# EAGLE design emonDCduo-ESP v3.3 (EAGLE 9.2.2)
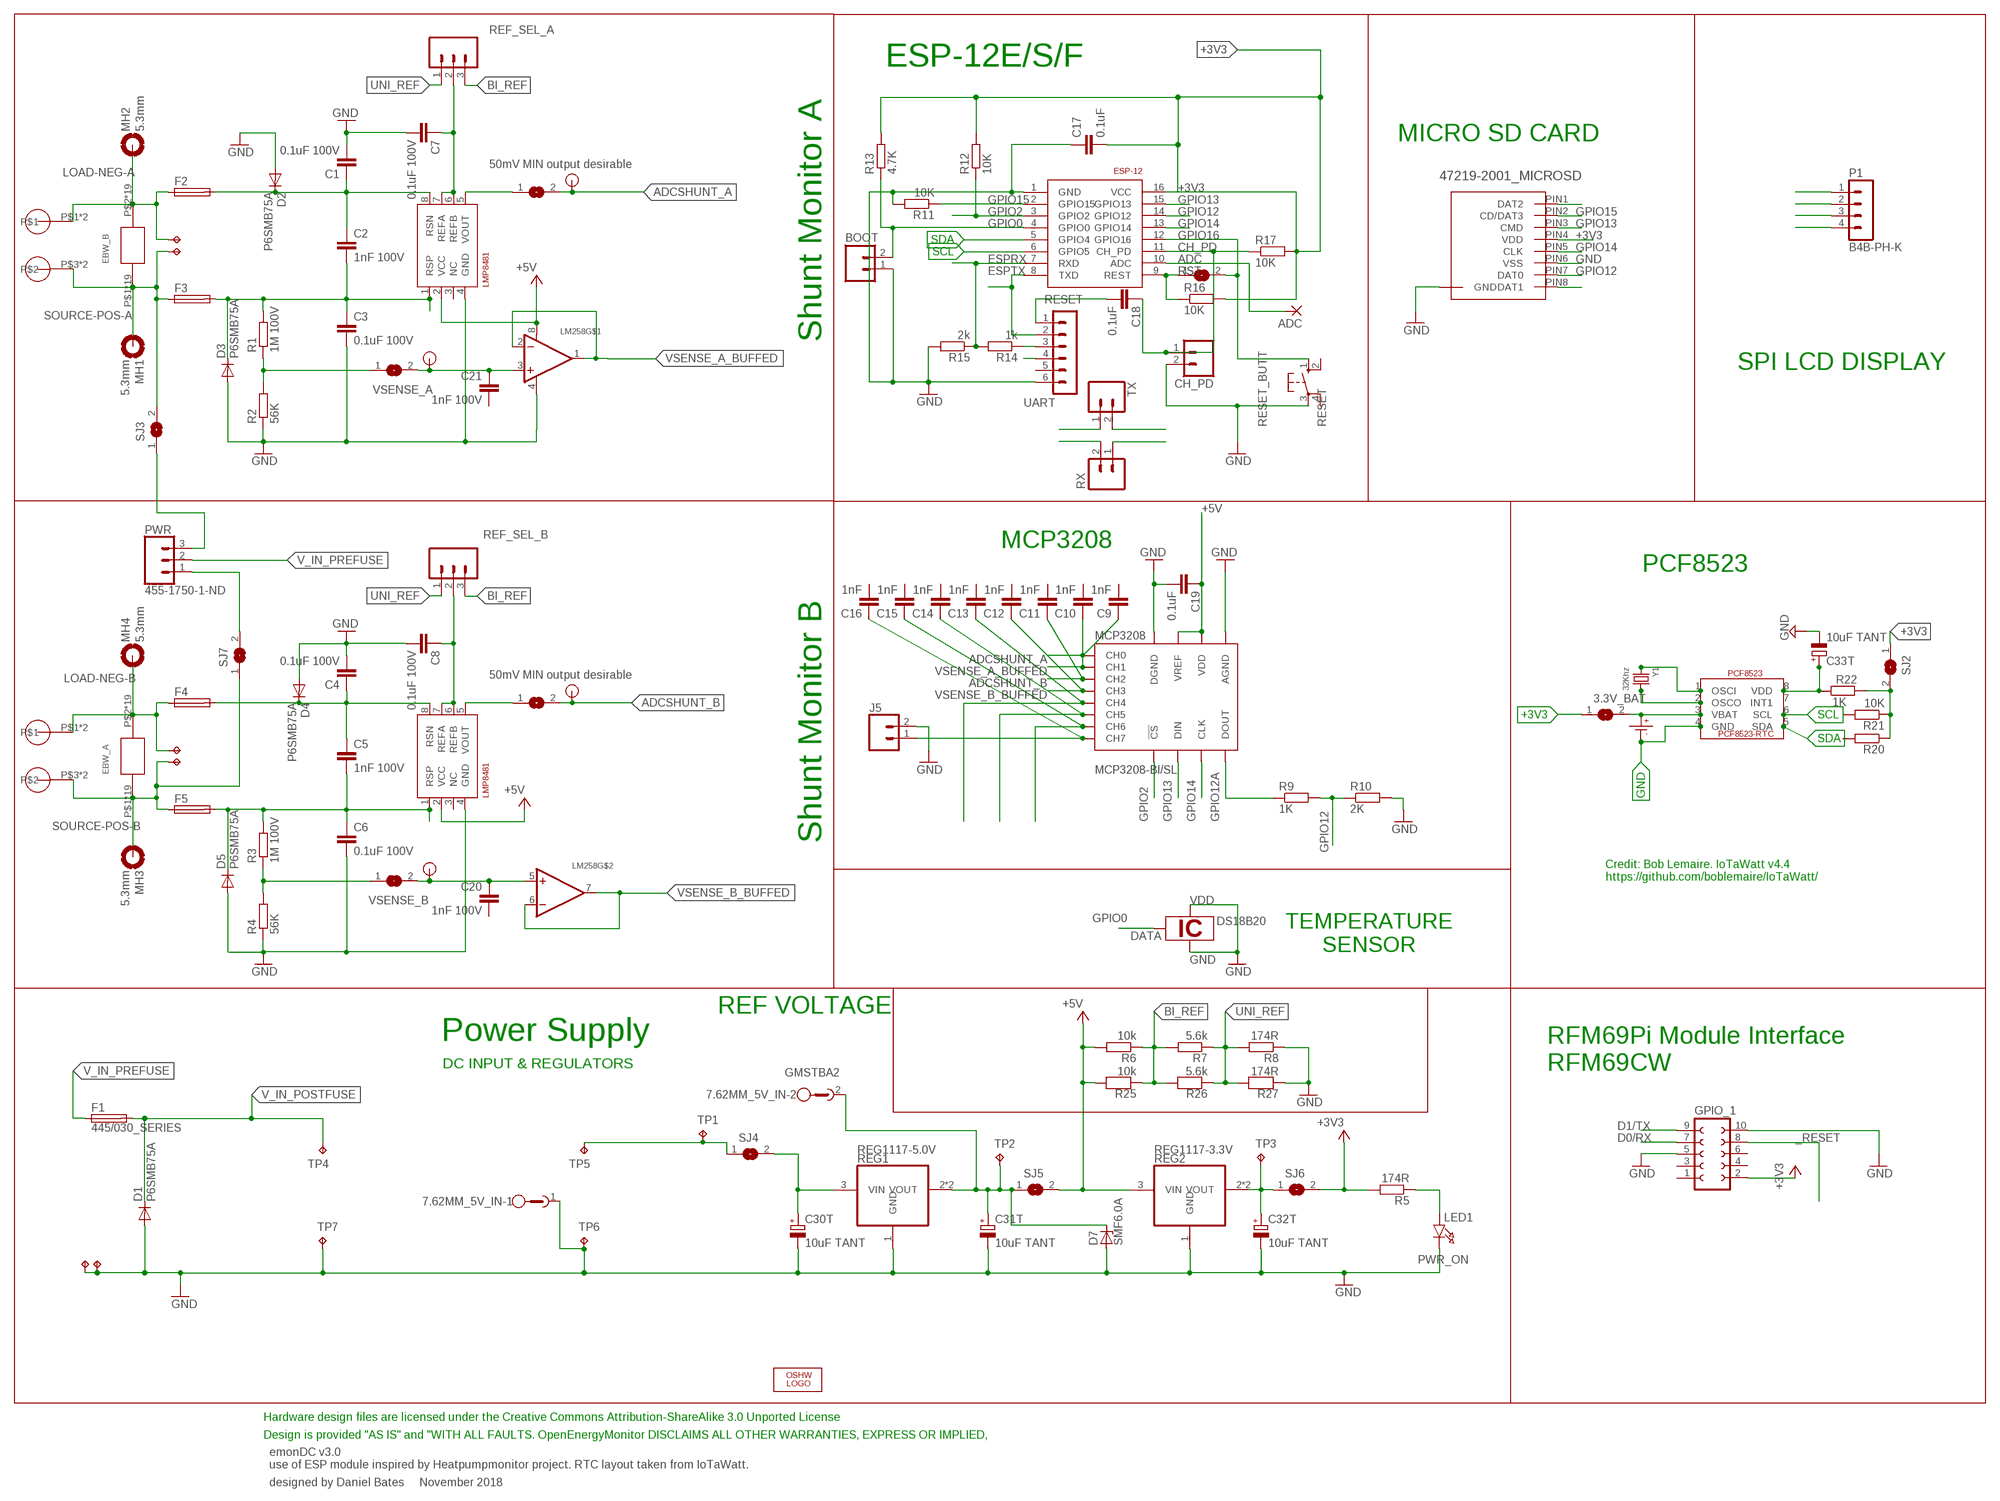
[diagram p0: schematic, sheet 1]

## Parts
3.3V_BAT  SOLDERJUMPERCLOSED  [SOLDERJUMPER_CLOSEDWIRE]
7.62MM_5V_IN  GMSTBA2  [GMSTBA2]
ADC  2,15/1,0  [2,15/1,0]
BOOT  M02PTH  [1X02]
C1  0.1uF 100V  C-EUC0603  [C0603]
C2  1nF 100V  C-EUC0603  [C0603]
C3  0.1uF 100V  C-EUC0603  [C0603]
C4  0.1uF 100V  C-EUC0603  [C0603]
C5  1nF 100V  C-EUC0603  [C0603]
C6  0.1uF 100V  C-EUC0603  [C0603]
C7  0.1uF 100V  C-EUC0603  [C0603]
C8  0.1uF 100V  C-EUC0603  [C0603]
C9  1nF  C-EUC0603  [C0603]
C10  1nF  C-EUC0603  [C0603]
C11  1nF  C-EUC0603  [C0603]
C12  1nF  C-EUC0603  [C0603]
C13  1nF  C-EUC0603  [C0603]
C14  1nF  C-EUC0603  [C0603]
C15  1nF  C-EUC0603  [C0603]
C16  1nF  C-EUC0603  [C0603]
C17  0.1uF  C-EUC0603  [C0603]
C18  0.1uF  C-EUC0603  [C0603]
C19  0.1uF  C-EUC0603  [C0603]
C20  1nF 100V  C-EUC0603  [C0603]
C21  1nF 100V  C-EUC0603  [C0603]
C30T  10uF TANT  CPOL-EUC0603POL  [C0603POL]
C31T  10uF TANT  CPOL-EUC0603POL  [C0603POL]
C32T  10uF TANT  CPOL-EUC0603POL  [C0603POL]
C33T  10uF TANT  CPOL-EUC0603POL  [C0603POL]
CH_PD  M02PTH  [1X02]
CR1220  CR1220SMD  [CR1220SMD]
D1  P6SMB75A  DIODE-DO214AA  [DO214AA]
D2  P6SMB75A  DIODE-DO214AA  [DO214AA]
D3  P6SMB75A  DIODE-DO214AA  [DO214AA]
D4  P6SMB75A  DIODE-DO214AA  [DO214AA]
D5  P6SMB75A  DIODE-DO214AA  [DO214AA]
D7  SMF6.0A  [SOD123F]
EBW_A  EBW_SERIES_15.2MM  [EBW_SERIES_15.2MM]
EBW_B  EBW_SERIES_15.2MM  [EBW_SERIES_15.2MM]
ESP-12  ESP8266_ESP-12  [ESP8266-ESP12]
F1  445/030_SERIES  [445/030_SERIES_LITTELFUSE]
F2  TR5  [TR5]
F3  TR5  [TR5]
F4  TR5  [TR5]
F5  TR5  [TR5]
GPIO_1  FE05-2_RFM69PI_OUTLINERFM69PI  [FE05-2_RFM69PI_OULTINE]
IC1  DS18B20  [TO92-]
J5  CONN_02  [1X02]
LED1  PWR_ON  LED1206  [CHIPLED_1206]
LM258  LM358  [SOIC8_150MIL]
LOGO1  OSHW_LOGO_6MILX0200-NT  [OSHW_6X200_NOTEXT]
MCP3208  MCP3208-BI/SL  [SOIC16]
MH1  5.3mm  MOUNT-PAD-ROUND5.3  [5,3//11-PAD]
MH2  5.3mm  MOUNT-PAD-ROUND5.3  [5,3//11-PAD]
MH3  5.3mm  MOUNT-PAD-ROUND5.3  [5,3//11-PAD]
MH4  5.3mm  MOUNT-PAD-ROUND5.3  [5,3//11-PAD]
MICRO_SD  47219-2001_MICROSD  [47219-2001_MICROSD]
MOUNT_10.16_A  MOLEX_39970-003  [2/10,16]
MOUNT_10.16_B  MOLEX_39970-003  [2/10,16]
P1  B4B-PH-K  [B4B-PH-K]
PCF8523  PCF8523_RTC  [SOIC_8]
PWR  455-1750-1-ND  CONN_03  [1X03]
R1  1M 100V  R-EU_0207/2V  [0207/2V]
R2  56K  R-EU_0207/2V  [0207/2V]
R3  1M 100V  R-EU_0207/2V  [0207/2V]
R4  56K  R-EU_0207/2V  [0207/2V]
R5  174R  R-EU_R0603  [R0603]
R6  10k  R-EU_0207/10  [0207/10]
R7  5.6k  R-EU_0207/10  [0207/10]
R8  174R  R-EU_0207/10  [0207/10]
R9  1K  R-EU_R0603  [R0603]
R10  2K  R-EU_R0603  [R0603]
R11  10K  R-EU_R0603  [R0603]
R12  10K  R-EU_R0603  [R0603]
R13  4.7K  R-EU_R0603  [R0603]
R14  1k  R-EU_R0603  [R0603]
R15  2k  R-EU_R0603  [R0603]
R16  10K  R-EU_R0603  [R0603]
R17  10K  R-EU_R0603  [R0603]
R20  10K  R-EU_R0603  [R0603]
R21  10K  R-EU_R0603  [R0603]
R22  1K  R-EU_R0603  [R0603]
R25  10k  RESISTOR0603  [0603]
R26  5.6k  RESISTOR0603  [0603]
R27  174R  RESISTOR0603  [0603]
REF_SEL_A  455-1750-1-ND  CONN_03  [1X03]
REF_SEL_B  455-1750-1-ND  CONN_03  [1X03]
REG1  REG1117-5.0V  REG1117  [SOT223]
REG2  REG1117-3.3V  REG1117  [SOT223]
RESET  RESET_BUTT  10-XX  [B3F-10XX]
RX  M02PTH  [1X02]
SHUNTMON-A  LMP8481  LMP8481-H  [S-PDSO-G08]
SHUNTMON-B  LMP8481  LMP8481-H  [S-PDSO-G08]
SJ1  SOLDERJUMPERCLOSED  [SOLDERJUMPER_CLOSEDWIRE]
SJ2  SOLDERJUMPERCLOSED  [SOLDERJUMPER_CLOSEDWIRE]
SJ3  SJ  [SJ]
SJ4  SOLDERJUMPERCLOSED  [SOLDERJUMPER_CLOSEDWIRE]
SJ5  SOLDERJUMPERCLOSED  [SOLDERJUMPER_CLOSEDWIRE]
SJ6  SOLDERJUMPERCLOSED  [SOLDERJUMPER_CLOSEDWIRE]
SJ7  SJ  [SJ]
SJ8  SOLDERJUMPERCLOSED  [SOLDERJUMPER_CLOSEDWIRE]
SJ9  SOLDERJUMPERCLOSED  [SOLDERJUMPER_CLOSEDWIRE]
SJ10  SOLDERJUMPERCLOSED  [SOLDERJUMPER_CLOSEDWIRE]
SJ11  SOLDERJUMPERCLOSED  [SOLDERJUMPER_CLOSEDWIRE]
TP1  TPPAD1-13  [P1-13]
TP2  TPPAD1-13  [P1-13]
TP3  TPPAD1-13  [P1-13]
TP4  TPPAD1-13Y  [P1-13Y]
TP5  TPPAD1-13Y  [P1-13Y]
TP6  TPPAD1-13Y  [P1-13Y]
TP7  TPPAD1-13Y  [P1-13Y]
TP8  TPPAD1-13Y  [P1-13Y]
TP9  TPPAD1-13Y  [P1-13Y]
TP10  TPPAD1-13Y  [P1-13Y]
TP11  TPPAD1-13Y  [P1-13Y]
TP12  TPPAD1-13Y  [P1-13Y]
TP13  TPPAD1-13Y  [P1-13Y]
TX  M02PTH  [1X02]
U$1  TP1.0MM  [TP1.0]
U$4  TP1.0MM  [TP1.0]
U$5  TP1.0MM  [TP1.0]
U$6  TP1.0MM  [TP1.0]
UART  UART  MA06-1  [MA06-1]
Y1  32Khz  CRYSTAL8X3.8SMT  [CRYSTAL_8X3.8]

## Nets
3.3V_PRE [thin_power]: C32T.1(+) REG2.2(VOUT) REG2.4(VOUT) SJ6.1 TP3.TP
5V_PRE [thin_power]: 7.62MM_5V_IN.2 C31T.1(+) D7.C REG1.2(VOUT) REG1.4(VOUT) SJ5.1 TP2.TP
6.5V [thin_power]: C30T.1(+) REG1.3(VIN) SJ4.2
+3V3 [thin_power2]: 3.3V_BAT.1 C15.1 C17.2 ESP-12.16(VCC) GPIO_1.2 MCP3208.7(CH6) MICRO_SD.PIN4(VDD) P1.3 R5.2 R12.2 R13.2 R16.2 R17.2 SJ2.1 SJ6.2
+5V [thin_power2]: C19.1 LM258.8(V+) MCP3208.15(VREF) MCP3208.16(VDD) R6.2 R25.2 REG2.3(VIN) SHUNTMON-A.2(VCC) SHUNTMON-B.2(VCC) SJ5.2 UART.4
_RESET: GPIO_1.8
ADC: ADC.1(P) ESP-12.10(ADC)
ADCSHUNT_A: C9.1 MCP3208.1(CH0) SJ11.2 U$6.P$1
ADCSHUNT_B: C11.1 MCP3208.3(CH2) SJ10.2 U$5.P$1
BI_REF: C13.1 MCP3208.5(CH4) R6.1 R7.2 R25.1 R26.2 REF_SEL_A.3 REF_SEL_B.3
CH7: C16.1 J5.1 MCP3208.8(CH7)
CH_PD: C18.1 CH_PD.1 ESP-12.11(CH_PD) R17.1
D0/RX: GPIO_1.7 TX.2
D1/TX: GPIO_1.9 RX.1
ESPRX: ESP-12.7(RXD) R14.2 R15.1 RX.2
ESPTX: ESP-12.8(TXD) TX.1 UART.2
GND: 7.62MM_5V_IN.1 BOOT.1 C1.2 C3.2 C4.2 C6.2 C7.2 C8.2 C17.1 C19.2 C30T.2(-) C31T.2(-) C32T.2(-) C33T.2(-) CH_PD.2 CR1220.P-(P$-) D1.A D2.A D3.A D4.A D5.A D7.A ESP-12.1(GND) GPIO_1.5 GPIO_1.10 IC1.1(GND) IC1.3(VDD) J5.2 LED1.C LM258.4(V-) MCP3208.9(DGND) MCP3208.14(AGND) MICRO_SD.P$1(GND) MICRO_SD.P$2(GND) MICRO_SD.P$3(GND) MICRO_SD.P$4(GND) MICRO_SD.PIN6(VSS) P1.4 PCF8523.4(GND) R2.1 R4.1 R8.1 R10.2 R11.2 R15.2 R27.1 REG1.1(GND) REG2.1(GND) RESET.3(P) SHUNTMON-A.4(GND) SHUNTMON-B.4(GND) TP6.TP TP7.TP TP12.TP TP13.TP UART.6
GPIO0: BOOT.2 ESP-12.4(GPIO0) IC1.2(DATA) R13.1
GPIO2: ESP-12.3(GPIO2) MCP3208.10(!CS) R12.1
GPIO12: ESP-12.14(GPIO12) MICRO_SD.PIN7(DAT0) R9.2 R10.1
GPIO12A: MCP3208.12(DOUT) R9.1
GPIO13: ESP-12.15(GPIO13) MCP3208.11(DIN) MICRO_SD.PIN3(CMD)
GPIO14: ESP-12.13(GPIO14) MCP3208.13(CLK) MICRO_SD.PIN5(CLK)
GPIO15: ESP-12.2(GPIO15) MICRO_SD.PIN2(CD/DAT3) R11.1
GPIO16: ESP-12.12(GPIO16) RESET.1(S) SJ1.2
LOAD-NEG-A [power]: EBW_B.P$2 EBW_B.P$18 EBW_B.P$19 EBW_B.P$20 EBW_B.P$21 EBW_B.P$22 EBW_B.P$23 EBW_B.P$24 EBW_B.P$25 EBW_B.P$26 EBW_B.P$27 EBW_B.P$28 EBW_B.P$29 EBW_B.P$30 EBW_B.P$31 EBW_B.P$32 EBW_B.P$36 EBW_B.P$37 EBW_B.P$38 F2.1 MH2.B5,5(MOUNT) MOUNT_10.16_A.P$1 MOUNT_10.16_A.P$2 TP11.TP
LOAD-NEG-A_T [thin_power]: C1.1 C2.1 D2.C F2.2 SHUNTMON-A.8(RSN)
LOAD-NEG-B [power]: EBW_A.P$2 EBW_A.P$18 EBW_A.P$19 EBW_A.P$20 EBW_A.P$21 EBW_A.P$22 EBW_A.P$23 EBW_A.P$24 EBW_A.P$25 EBW_A.P$26 EBW_A.P$27 EBW_A.P$28 EBW_A.P$29 EBW_A.P$30 EBW_A.P$31 EBW_A.P$32 EBW_A.P$36 EBW_A.P$37 EBW_A.P$38 F4.1 MH4.B5,5(MOUNT) MOUNT_10.16_B.P$1 MOUNT_10.16_B.P$2 TP9.TP
LOAD-NEG-B_T [thin_power]: C4.1 C5.1 D4.C F4.2 SHUNTMON-B.8(RSN)
N$1: SJ4.1 TP1.TP TP5.TP
N$3 [power]: PWR.3 SJ3.1
N$4 [power]: PWR.1 SJ7.2
N$5: LED1.A R5.1
N$7: MICRO_SD.PIN1(DAT2)
N$10: SHUNTMON-B.5(VOUT) SJ10.1
N$11: SHUNTMON-A.5(VOUT) SJ11.1
N$32: MICRO_SD.PIN8(DAT1)
N$36: R14.1 UART.3
N$44: PCF8523.2(OSCO) Y1.P$4
N$45: PCF8523.1(OSCI) Y1.P$1
REF_A_INPUT: C7.1 REF_SEL_A.2 SHUNTMON-A.6(REFB) SHUNTMON-A.7(REFA)
REF_B_INPUT: C8.1 REF_SEL_B.2 SHUNTMON-B.6(REFB) SHUNTMON-B.7(REFA)
RESET: C18.2 UART.1
RST: ESP-12.9(REST) R16.1 SJ1.1
SCL: ESP-12.6(GPIO5) P1.2 PCF8523.6(SCL)
SDA: ESP-12.5(GPIO4) P1.1 PCF8523.5(SDA)
SOURCE-POS-A [power]: EBW_B.P$1 EBW_B.P$3 EBW_B.P$4 EBW_B.P$5 EBW_B.P$6 EBW_B.P$7 EBW_B.P$8 EBW_B.P$9 EBW_B.P$10 EBW_B.P$11 EBW_B.P$12 EBW_B.P$13 EBW_B.P$14 EBW_B.P$15 EBW_B.P$16 EBW_B.P$17 EBW_B.P$33 EBW_B.P$34 EBW_B.P$35 F3.1 MH1.B5,5(MOUNT) MOUNT_10.16_A.P$3 MOUNT_10.16_A.P$4 SJ3.2 TP10.TP
SOURCE-POS-A_T [thin_power]: C2.2 C3.1 D3.C F3.2 R1.2 SHUNTMON-A.1(RSP)
SOURCE-POS-B [power]: EBW_A.P$1 EBW_A.P$3 EBW_A.P$4 EBW_A.P$5 EBW_A.P$6 EBW_A.P$7 EBW_A.P$8 EBW_A.P$9 EBW_A.P$10 EBW_A.P$11 EBW_A.P$12 EBW_A.P$13 EBW_A.P$14 EBW_A.P$15 EBW_A.P$16 EBW_A.P$17 EBW_A.P$33 EBW_A.P$34 EBW_A.P$35 F5.1 MH3.B5,5(MOUNT) MOUNT_10.16_B.P$3 MOUNT_10.16_B.P$4 SJ7.1 TP8.TP
SOURCE-POS-B_T [thin_power]: C5.2 C6.1 D5.C F5.2 R3.2 SHUNTMON-B.1(RSP)
UNI_REF: C14.1 MCP3208.6(CH5) R7.1 R8.2 R26.1 R27.2 REF_SEL_A.1 REF_SEL_B.1
V_IN_POSTFUSE [power]: D1.C F1.P$3 F1.P$4 TP4.TP
V_IN_PREFUSE [power]: F1.P$1 F1.P$2 PWR.2
VBAT: 3.3V_BAT.2 CR1220.P+(P$+) PCF8523.3(VBAT)
VDD_PCF: C33T.1(+) PCF8523.8(VDD) R22.1
VDD_RTC_POSTJUMPER: R20.1 R21.1 R22.2 SJ2.2
VSENSE_A: R1.1 R2.2 SJ8.1
VSENSE_A_BUFFED: C10.1 LM258.1(OUT) LM258.2(-IN) MCP3208.2(CH1)
VSENSE_A_TP: C21.1 LM258.3(+IN) SJ8.2 U$1.P$1
VSENSE_B: R3.1 R4.2 SJ9.1
VSENSE_B_BUFFED: C12.1 LM258.6(-IN) LM258.7(OUT) MCP3208.4(CH3)
VSENSE_B_TP: C20.1 LM258.5(+IN) SJ9.2 U$4.P$1
Unconnected: C9.2 C10.2 C11.2 C12.2 C13.2 C14.2 C15.2 C16.2 C20.2 C21.2 GPIO_1.1 GPIO_1.3 GPIO_1.4 GPIO_1.6 PCF8523.7(INT1) R20.2 R21.2 RESET.2(S1) RESET.4(P1) SHUNTMON-A.3(NC) SHUNTMON-B.3(NC) UART.5

## Notes on the sheet
- ESP-12E/S/F
- MICRO SD CARD
- 50mV MIN output desirable
- Shunt Monitor A
- SPI LCD DISPLAY
- MCP3208
- PCF8523
- 50mV MIN output desirable
- Shunt Monitor B
- Credit: Bob Lemaire. IoTaWatt v4.4
  https://github.com/boblemaire/IoTaWatt/
- TEMPERATURE
  SENSOR
- REF VOLTAGE
- Power Supply
- DC INPUT & REGULATORS
- RFM69Pi Module Interface
  RFM69CW
- Hardware design files are licensed under the Creative Commons Attribution-ShareAlike 3.0 Unported License
- Design is provided "AS IS" and "WITH ALL FAULTS. OpenEnergyMonitor DISCLAIMS ALL OTHER WARRANTIES, EXPRESS OR IMPLIED,
- emonDC v3.0
  use of ESP module inspired by Heatpumpmonitor project. RTC layout taken from IoTaWatt.
- designed by Daniel Bates     November 2018

## Library data of the parts
3.3V_BAT SJ1 SJ2 SJ4-SJ6 SJ8-SJ11 = microbuilder:SOLDERJUMPER: SMD Solder JUMPER Solder the two pads together to create a connection, or remove the solder to break it. REFLOW - Use this footprint for solder paste and reflow ovens. WAVE - Use this footprint for hand-soldering (larger pads). CLOSED - Has a trace between the two pads to ensure it is closed by default. The trace needs to be cut to disable the jumper, and can be closed again by creating a solder bridge between the two pads.
7.62MM_5V_IN = con-phoenix-762:GMSTBA2: PHOENIX; MF: FARNELL; MPN: 1757242; OC_FARNELL: 3705171; OC_NEWARK: 71C4161
ADC = wirepad:2,15/1,0: THROUGH-HOLE PAD
BOOT CH_PD RX TX = SparkFun:M02: Header 2 Standard 2-pin 0.1" header. Use with straight break away headers (SKU : PRT-00116), right angle break away headers (PRT-00553), swiss pins (PRT-00743), machine pins (PRT-00117), and female headers (PRT-00115). Molex polarized connector foot print use with SKU : PRT-08233 with associated crimp pins and housings.
C1-C8 C20 C21 = rcl:C-EU: CAPACITOR, European symbol; MPN: C1608X7S2A104K080AB
C9-C19 = rcl:C-EU: CAPACITOR, European symbol
C30T C31T C32T C33T = rcl7:CPOL-EU: POLARIZED CAPACITOR, European symbol
CR1220 = IotaWatt_parts:CR1220SMD: CR1220 Battery SMD; MPN: Harwin S8411-45R
D1-D5 = diode:DIODE-: DIODE
D7 = smf_10:SMF*A: SMF Series TVS Diodes Source: http://www.littelfuse.com/~/media/electronics/datasheets/tvs_diodes/littelfuse_tvs_diode_smf_datasheet.pdf.pdf; MF: Littelfuse; MPN: SMF6.0A; OC_FARNELL: unknown; OC_NEWARK: unknown
EBW_A EBW_B = EBW series SHUNT:EBW_SERIES_15.2MM
ESP-12 = ESP8266-ESP12:ESP8266_ESP-12
F1 = LITTELFUSE 455:030 SERIES:445/030_SERIES: MPN 04450001N
F2-F5 = fuse:TR5: FUSE Wickmann; OC_FARNELL: unknown; OC_NEWARK: unknown
GPIO_1 = con-lsta-RFM69Pi:FE05-2_RFM69PI_OUTLINE: FEMALE HEADER
IC1 = DS18B20:DS18B20: Programmable Resolution Digital Thermometer This chip provides a onewire thermosensor with approx. 0.5°C accuracy. A programmable over/undertemperure alarm is available. The precision can be set from 9..12 bits. Notes: Vdd must be applied for accurate measurements at low temperatures, as the parasite power circuit otherwise heats the sensor. If parasite power is used, Vdd has to be connected to GND. The DS1822 is a low-cost thermometer chip, the DS18S20 is similar to the DS18B20, but with 9 Bit precision only. Author: Jan Kandziora <jjj@gmx.de>
J5 = SparkFun-Connectors:CONN_02: Multi connection point. Often used as Generic Header-pin footprint for 0.1 inch spaced/style header connections On any of the 0.1 inch spaced packages, you can populate with these: Break Away Headers - Straight <https://www.sparkfun.com/products/116> (PRT-00116) Break Away Male Headers - Right Angle <https://www.sparkfun.com/products/553> (PRT-00553) Female Headers <https://www.sparkfun.com/products/115> (PRT-00115) Break Away Headers - Machine Pin <https://www.sparkfun.com/products/117> (PRT-00117) Break Away Female Headers - Swiss Machine Pin <https://www.sparkfun.com/products/743> (PRT-00743) For SCREWTERMINALS and SPRING TERMINALS visit here: Screw Terimnals on SparkFun.com <https://www.sparkfun.com/search/results?term=Screw+Terminals> (5mm/3.5mm/2.54mm spacing) This device is also useful as a general connection point to wire up your design to another part of your project. Our various solder wires solder well into these plated through hole pads. Hook-Up Wire - Assortment (Stranded, 22 AWG) <https://www.sparkfun.com/products/11375> (PRT-11375) Hook-Up Wire - Assortment (Solid Core, 22 AWG) <https://www.sparkfun.com/products/11367> (PRT-11367) View the entire wire category on our website here <https://www.sparkfun.com/categories/141> Special notes: Molex polarized connector foot print use with: PRT-08233 with associated crimp pins and housings. 2.54_SCREWTERM for use with PRT-10571. 3.5mm Screw Terminal footprints for PRT-08084 5mm Screw Terminal footprints for use with PRT-08432
LED1 = microbuilder:LED: LED 0603 - 0603 Surface Mount Package 2mA: Green LED - Low Power (3.9mcd, 2ma, 1.7Vf) - Digikey: 475-2709-2-ND Orange LED - Low Power (9.8mcd, 2ma, 1.8Vf) - Digikey: 475-1194-2-ND Red LED - Low Power (5mcd, 2ma, 1.8Vf) - Digikey: 475-1195-2-ND Yellow LED - Low Power (7mcd, 2ma, 1.8Vf) - Digikey: 475-1196-2-ND 5mA: Blue LED - Low Power (17mcd, 5ma, 2.9Vf) - Digikey: LNJ937W8CRACT-ND 0805 - 0805 Surface Mount Package 2mA: Red LED (8.8mcd, 2mA, 1.8Vf, Clear) - Low Power [Digikey: 475-2510-1-ND] Green LED (5mcd, 2mA, 1.8Vf, Clear) - Low Power [Digikey: 475-2730-1-ND] Yellow LED (11.3mcd, 2mA, 1.8Vf, Clear) - Low Power [Digikey: 475-2555-1-ND] 20mA: Red LED (104mcd, 20mA, Diffused) - LS R976 [Digikey: 475-1278-6-ND] Red LED (12mcd, 20mA, 2.0Vf, Clear) - APT2012EC [Digikey: 754-1128-1-ND] Green LED (15mcd, 20mA, 2.2Vf, Clear) - APT2012GC [Digikey: 754-1131-1-ND] Orange LED (160mcd, 20mA, 2.1Vf, Clear) - APT2012SECK [Digikey: 754-1130-1-ND] 1206 - 1206 Surface Mount Package Green LED (26mcd, 20mA, Diffused) - LG N971 [Digikey: 475-1407-6-ND] Red LED (15mcd, 20mA, Diffused) - LH N974 [Digikey: 475-1416-6-ND]
LM258 = microbuilder:LM358: LM358 Dual Operational Amplifier Digikey: LM358AMXFSCT-ND
LOGO1 = ohw-logo:OSHW_LOGO_6MIL; OC_FARNELL: unknown
MCP3208 = MCP3208:MCP3208
MH1-MH4 = holes-db:MOUNT-PAD-ROUND: MOUNTING PAD, round
MICRO_SD = MOLEX 47219-2001:47219-2001_MICROSD
MOUNT_10.16_A MOUNT_10.16_B = 10.16mm terminal block:MOLEX_39970-003
P1 = JST-PH:B4B-PH-K: HEADER
PCF8523 = emonDC parts:PCF8523_RTC: PCF8523-RTC SOIC-8
PWR = SparkFun-Connectors:CONN_03: Multi connection point. Often used as Generic Header-pin footprint for 0.1 inch spaced/style header connections On any of the 0.1 inch spaced packages, you can populate with these: Break Away Headers - Straight <https://www.sparkfun.com/products/116> (PRT-00116) Break Away Male Headers - Right Angle <https://www.sparkfun.com/products/553> (PRT-00553) Female Headers <https://www.sparkfun.com/products/115> (PRT-00115) Break Away Headers - Machine Pin <https://www.sparkfun.com/products/117> (PRT-00117) Break Away Female Headers - Swiss Machine Pin <https://www.sparkfun.com/products/743> (PRT-00743) Stackable Header - 3 Pin (Female, 0.1") <https://www.sparkfun.com/products/13875> (PRT-13875) For SCREWTERMINALS and SPRING TERMINALS visit here: Screw Terimnals on SparkFun.com <https://www.sparkfun.com/search/results?term=Screw+Terminals> (5mm/3.5mm/2.54mm spacing) This device is also useful as a general connection point to wire up your design to another part of your project. Our various solder wires solder well into these plated through hole pads. Hook-Up Wire - Assortment (Stranded, 22 AWG) <https://www.sparkfun.com/products/11375> (PRT-11375) Hook-Up Wire - Assortment (Solid Core, 22 AWG) <https://www.sparkfun.com/products/11367> (PRT-11367) View the entire wire category on our website here <https://www.sparkfun.com/categories/141> Special notes: Molex polarized connector foot print use with SKU : PRT-08232 with associated crimp pins and housings.; PROD_ID: XXX-00000
R1 R3 = rcl7:R-EU_: RESISTOR, European symbol; MPN: MCWR06X1003FTL
R2 R4 = rcl7:R-EU_: RESISTOR, European symbol; MPN: MCWR06X5901FTL
R5 = rcl:R-EU_: RESISTOR, European symbol; SPICEPREFIX: R
R6-R8 = rcl7:R-EU_: RESISTOR, European symbol
R9 R10 = rcl:R-EU_: RESISTOR, European symbol; MPN: MCWR06X5901FTL
R11-R17 R20 R21 = rcl:R-EU_: RESISTOR, European symbol
R22 = rcl@1:R-EU_: RESISTOR, European symbol
R25-R27 = microbuilder:RESISTOR: Resistors 0402 - 0402 Surface Mount Package 22 Ohm 1% 1/16W [Digikey: 311-22.0LRTR-ND] 33 Ohm 5% 1/16W 1.0K 5% 1/16W 1.5K 5% 1/16W 2.0K 1% 1/16W 10.0K 1% 1/16W [Digikey: 311-10.0KLRTR-ND] 10.0K 5% 1/16W [Digikey: RMCF0402JT10K0TR-ND] 12.1K 1% 1/16W [Digikey: 311-22.0LRTR-ND] 100.0K 5% 1/16W 0603 - 0603 Surface Mount Package 0 Ohm 1/10 Watt 1% Resistor 15 Ohm 1/10 Watt 1% Resistor 33 Ohm 1/10 Watt 1% Resistor 49.9 Ohm 1/10 Watt 1% Resistor 100 Ohm 1/10 Watt 1% Resistor 150 Ohm 1/10 Watt 1% Resistor 240 Ohm 1/10 Watt 1% Resistor 390 Ohm 1/10 Watt 1% Resistor 560 Ohm 1/10 Watt 1% Resistor 680 Ohm 1/10 Watt 1% Resistor 750 Ohm 1/10 Watt 1% Resistor 1.0K Ohm 1/10 Watt 1% Resistor 1.5K Ohm 1/10 Watt 1% Resistor 2.0K Ohm 1/10 Watt 1% Resistor 2.2K Ohm 1/10 Watt 1% Resistor 3.3K Ohm 1/10 Watt 1% Resistor 4.7K Ohm 1/10 Watt 1% Resistor 10.0K Ohm 1/10 Watt 1% Resistor 12.0K Ohm 1/10 Watt 1% Resistor 12.1K Ohm 1/10 Watt 1% Resistor 20.0K Ohm 1/10 Watt 1% Resistor 33.0K Ohm 1/10 Watt 1% Resistor 100.0K Ohm 1/10 Watt 1% Resistor 0805 - 0805 Surface Mount Package 0 Ohm 1/8 Watt 1% Resistor 33 Ohm 1/8 Watt 1% Resistor 100 Ohm 1/8 Watt 1% Resistor 150 Ohm 1/8 Watt 1% Resistor 200 Ohm 1/8 Watt 1% Resistor 240 Ohm 1/8 Watt 1% Resistor 330 Ohm 1/8 Watt 1% Resistor 390 Ohm 1/8 Watt 1% Resistor 470 Ohm 1/8 Watt 1% Resistor 1.0K Ohm 1/8 Watt 1% Resistor 1.5K Ohm 1/8 Watt 1% Resistor 2.0K Ohm 1/8 Watt 1% Resistor 4.7K Ohm 1/8 Watt 1% Resistor 5.1K Ohm 1/8 Watt 1% Resistor 5.6K Ohm 1/8 Watt 1% Resistor 10.0K Ohm 1/8 Watt 1% Resistor 22.0K Ohm 1/8 Watt 1% Resistor 33.0K Ohm 1/8 Watt 1% Resistor 100K Ohm 1/8 Watt 1% Resistor 1206 - 1206 Surface Mount Package 2012 - 2010 Surface Mount Package 0.11 Ohm 1/2 Watt 1% Resistor - Digikey: RHM.11UCT-ND
REF_SEL_A REF_SEL_B = SparkFun-Connectors:CONN_03: Multi connection point. Often used as Generic Header-pin footprint for 0.1 inch spaced/style header connections On any of the 0.1 inch spaced packages, you can populate with these: Break Away Headers - Straight <https://www.sparkfun.com/products/116> (PRT-00116) Break Away Male Headers - Right Angle <https://www.sparkfun.com/products/553> (PRT-00553) Female Headers <https://www.sparkfun.com/products/115> (PRT-00115) Break Away Headers - Machine Pin <https://www.sparkfun.com/products/117> (PRT-00117) Break Away Female Headers - Swiss Machine Pin <https://www.sparkfun.com/products/743> (PRT-00743) Stackable Header - 3 Pin (Female, 0.1") <https://www.sparkfun.com/products/13875> (PRT-13875) For SCREWTERMINALS and SPRING TERMINALS visit here: Screw Terimnals on SparkFun.com <https://www.sparkfun.com/search/results?term=Screw+Terminals> (5mm/3.5mm/2.54mm spacing) This device is also useful as a general connection point to wire up your design to another part of your project. Our various solder wires solder well into these plated through hole pads. Hook-Up Wire - Assortment (Stranded, 22 AWG) <https://www.sparkfun.com/products/11375> (PRT-11375) Hook-Up Wire - Assortment (Solid Core, 22 AWG) <https://www.sparkfun.com/products/11367> (PRT-11367) View the entire wire category on our website here <https://www.sparkfun.com/categories/141> Special notes: Molex polarized connector foot print use with SKU : PRT-08232 with associated crimp pins and housings.; MF: MULTICOMP; MPN: 2212S-02SG-85; OC_FARNELL: 1593458; PROD_ID: XXX-00000
REG1 = burr-brown-db:REG1117: 800mA and 1A Low Dropout (LDO) Positive Regulator 1.8V, 2.5V, 2.85V, 3.3V, 5V, and Adj; MF: TEXAS INSTRUMENTS; MPN: REG1117-5.0; OC_FARNELL: 1097566; OC_NEWARK: 14P6981
REG2 = burr-brown-db:REG1117: 800mA and 1A Low Dropout (LDO) Positive Regulator 1.8V, 2.5V, 2.85V, 3.3V, 5V, and Adj; MF: TEXAS INSTRUMENTS; MPN: REG1117-3.3; OC_FARNELL: 1097566; OC_NEWARK: 14P6981
RESET = switch-omron:10-XX: OMRON SWITCH; MPN: B3F-1000; OC_FARNELL: 176432; OC_NEWARK: 36M3542
SHUNTMON-A = lmp8481b:LMP8481: LMP8481MM-H/NOPB 100V/V; MF: TEXAS INSTRUMENTS; MPN: LMP8481MME-S/NOPB; OC_FARNELL: 2322044
SHUNTMON-B = lmp8481b:LMP8481: LMP8481MM-H/NOPB 100V/V; MF: TEXAS INSTRUMENTS; MPN: LMP8481MME-H/NOPB; OC_FARNELL: 2322044
SJ3 SJ7 = jumper:SJ: SMD solder JUMPER
TP1-TP13 = testpad:TP: Test pad
U$1 U$4-U$6 = 1mm tesp pad:TP1.0MM
UART = JeeLabs:MA06-1: PIN HEADER
Y1 = microbuilder:CRYSTAL: Crystals HC49UP - Surface Mount Crystal 4.0MHz 18pF +/-30ppm Surface Mount Crystal [Digikey: 535-9857-1-ND] 12.0 MHz Surface Mount Crystal [Digikey: 535-9869-6-ND] 25.0 MHz Surface Mount Crystal [Digikey: 535-9078-1-ND] 2.5 x 2.0mm - MEMs SMT Crystal 16.0 MHz 10pF 20ppm 2.5 x 2.0mm Crystal [Digikey -40-85°C: 535-10923-1-ND] 3.2 x 2.5mm - MEMs SMT Crystal 12.0 MHz 8pF 15ppm 3.2 x 2.5mm Crystal [Digikey: -10-70°C: 644-1047-1-ND -40-125°C: 644-1128-1-ND] 16.0 MHz 8pF 15ppm 3.2 x 2.5mm Crystal [Digikey: -10-70°C: 644-1049-1-ND -40-125°C: 644-1129-2-ND] 16.0 MHz 10pF 10ppm 3.2 x 2.5mm Crystal [Digikey: 644-1100-1-ND] 27.12 MHz 18pF 30ppm 3.2 x 2.5mm Crystal [Digikey: 887-1424-1-ND] 27.12MHz 10pF 10ppm 3.2 x 2.5mm Crystal [Digikey: 887-1329-1-ND] 4.9 x 1.8mm - MEMs SMT Crystal 32.768 KHz 12.5pF 20ppm 4.9 x 1.8mm Crystal [Digikey: SE2415CT-ND] 8.0 x 3.8mm - Surface Mount Crystal 32.768kHz 12.5pF 20ppm -40°C-85°C [Digikey: 535-9166-2-ND] Cylinder 32.768KHz Cylinder Crystal (2x6mm body) [Ex. Digikey: 300-8341-2-ND]

## Net classes
0 default: clearance 0.254 mm
1 power: width 0.61 mm, clearance 0.61 mm
2 thin_power: width 0.406 mm, clearance 0.305 mm
3 thin_power2: width 0.254 mm, clearance 0.254 mm

## Board
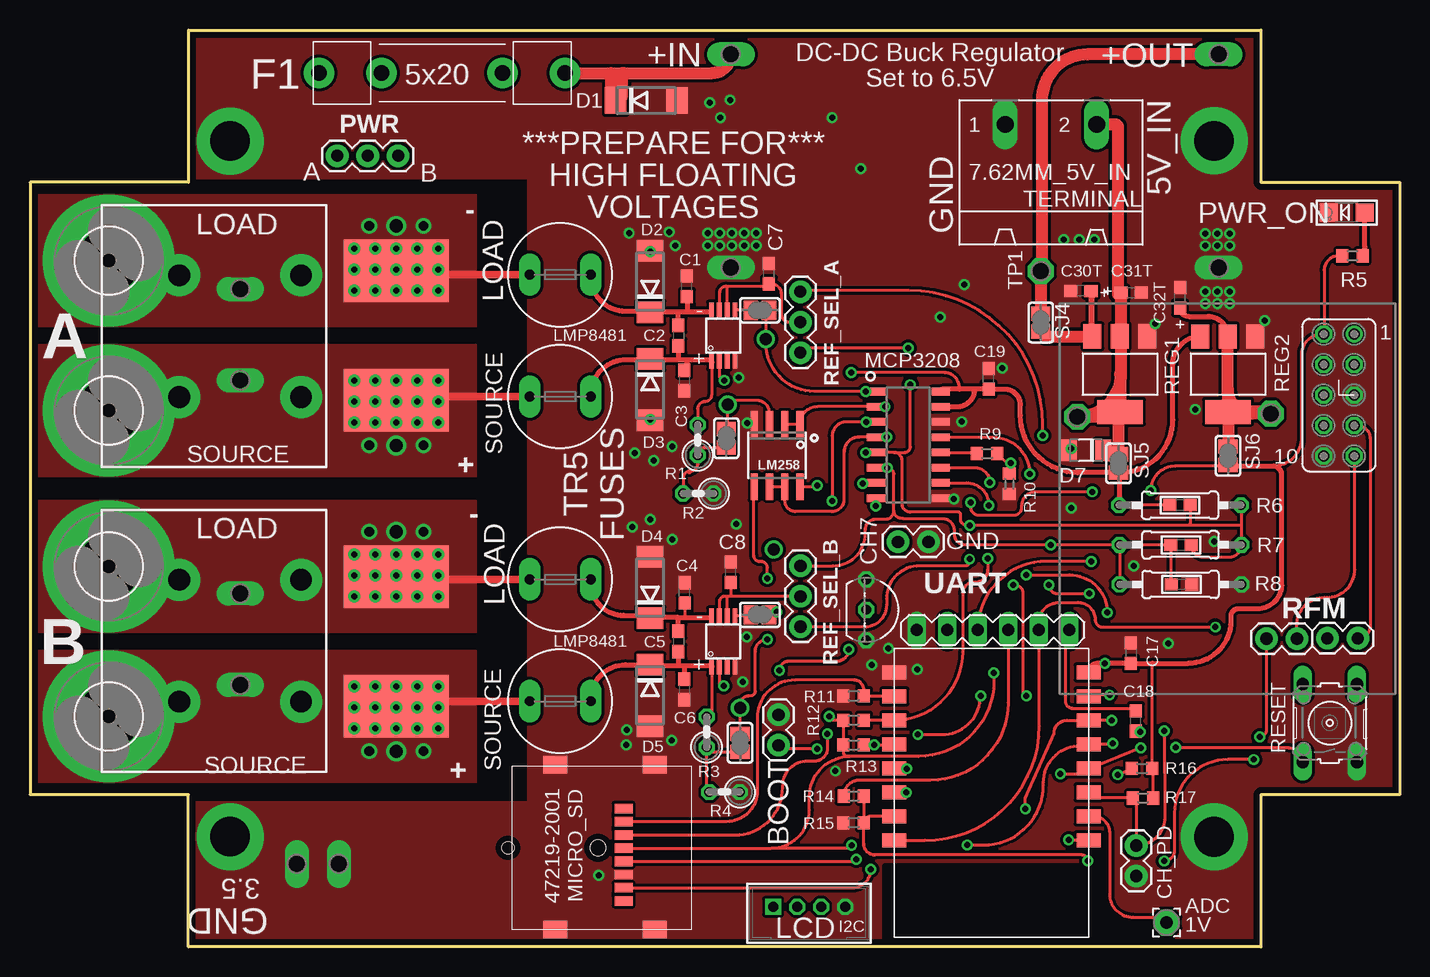
[diagram p1: board, top side]
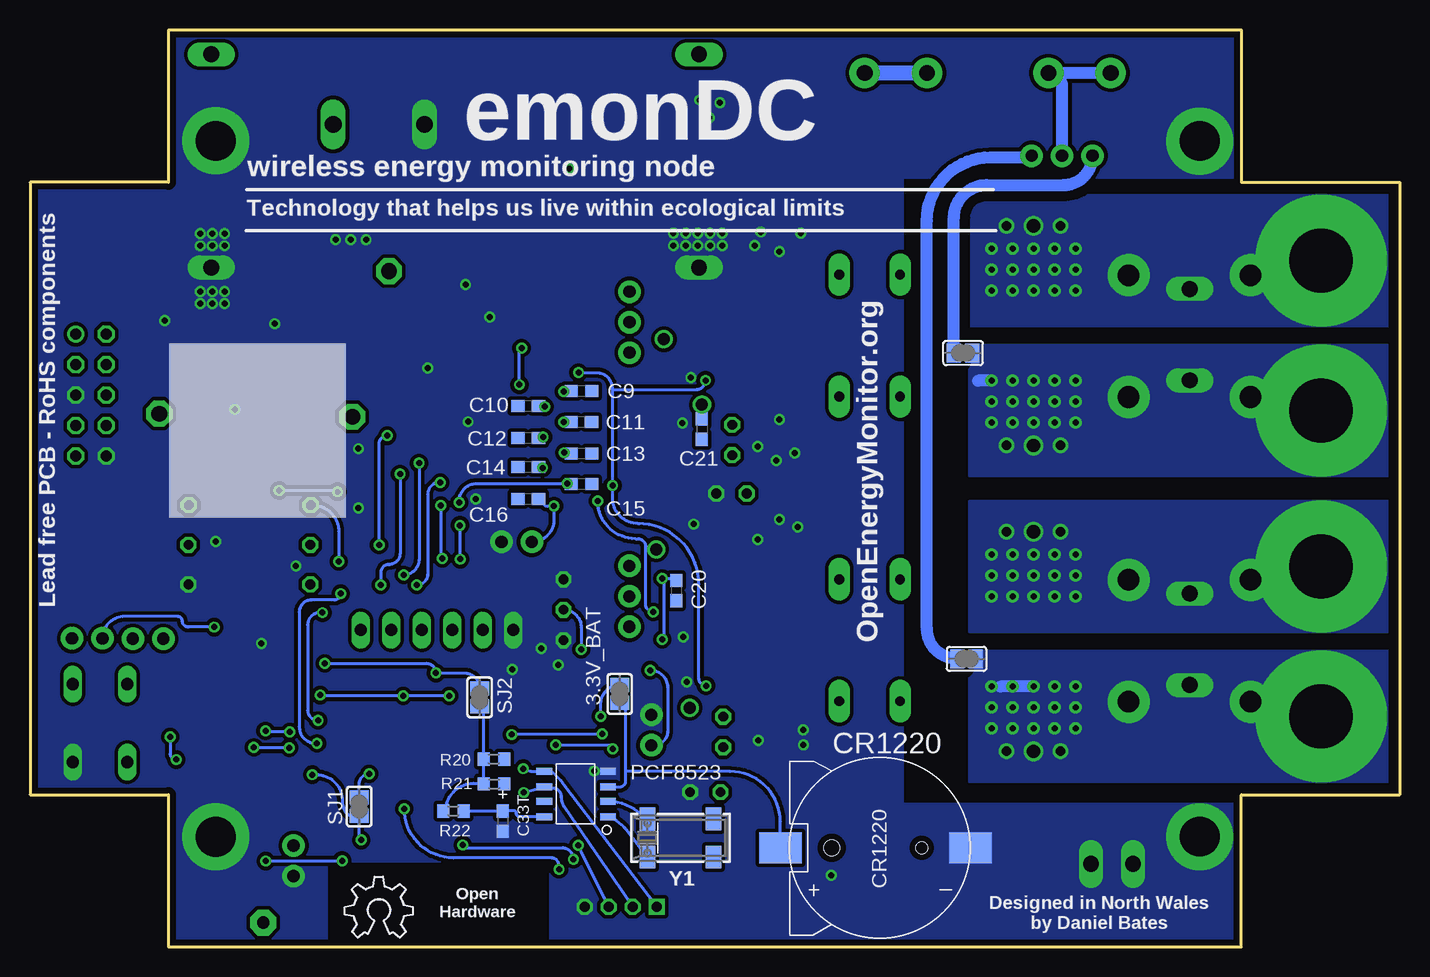
[diagram p2: board, bottom side, seen from below]

Size 114.15 x 76.45 mm. Coordinates in mm from the lower left corner, seen from the top.
Outline: 13.2,76.45 13.2,63.75 0,63.75 0,12.7 13.2,12.7 13.2,0 102.6,0 102.6,12.7 114.15,12.7 114.15,63.75 102.6,63.75 102.6,76.45 13.2,76.45
Copper layers (1*16): Top 0.035mm / dielectric 1.5mm / Bottom 0.035mm
Design rules "defaultDB *": minimum track width 10mil, minimum drill 19mil, track to track 8mil, track to pad 8mil, pad to pad 8mil, via to via 10mil, smd to smd 8mil, copper to edge 20mil, drill to drill 10mil, minimum pad ring 10mil, minimum via ring 8mil, stop-mask expansion 4mil, vias tented up to drill 0mil, thermal gap 7mil
tRestrict: area 71.2,-0.9 to 89,6.7
bRestrict: area 71.2,-0.9 to 89,6.7

### Footprints (pad centres in the part's own frame; a part is rotated, then mirrored left to right if it is on the bottom)
SOLDERJUMPER_CLOSEDWIRE = smd 1.168 x 1.6: 1 -0.762,0; 2 0.762,0 | smd 0.635 x 0.203: WIRE 0,0
GMSTBA2 = drill 1.397 long: 1 -3.81,5.08; 2 3.81,5.08
2,15/1,0 = drill 1.016 pad 2.159 octagon: 1 0,0
1X02 = drill 1.016 pad 1.88: 1 0,0; 2 2.54,0
C0603 = smd 1.1 x 1: 1 -0.85,0; 2 0.85,0
C0603POL = smd 1.1 x 1: 1 -0.85,0; 2 0.85,0
CR1220SMD = smd 3.54 x 2.6: P+ 8.3,0; P- -7.55,0 | hole 1: -3.5,0 | hole 1.3: 4,0
DO214AA = smd 1.8 x 2.2: A 2.55,0; C -2.55,0
SOD123F = smd 1.34 x 1.8: A 1.43,0; C -1.43,0
EBW_SERIES_15.2MM = smd 5.2 x 8.75: P$1 -5.4,0; P$2 5.4,0 | drill 0.5: P$3 -3.75,3.5; P$4 -3.75,1.75; P$5 -3.75,0; P$6 -3.75,-1.75; P$7 -3.75,-3.5; P$8 -5.5,3.5; P$9 -5.5,1.75; P$10 -5.5,0; P$11 -5.5,-1.75; P$12 -5.5,-3.5; P$13 -7.25,3.5; P$14 -7.25,1.75; P$15 -7.25,0; P$16 -7.25,-1.75; P$17 -7.25,-3.5; P$18 7.25,1.75; P$19 7.25,3.5; P$20 7.25,0; P$21 7.25,-1.75; P$22 7.25,-3.5; P$23 5.5,3.5; P$24 5.5,1.75; P$25 5.5,0; P$26 5.5,-1.75; P$27 5.5,-3.5; P$28 3.75,3.5; P$29 3.75,1.75; P$30 3.75,0; P$31 3.75,-1.75; P$32 3.75,-3.5 | drill 0.8: P$33 -9.155,2.258; P$35 -9.155,-2.258; P$36 9.155,2.258; P$38 9.155,-2.258 | drill 1.1: P$34 -9.155,0; P$37 9.155,0
ESP8266-ESP12 = smd 2 x 1.2: 1 16.2,2; 2 16.2,4; 3 16.2,6; 4 16.2,8; 5 16.2,10; 6 16.2,12; 7 16.2,14; 8 16.2,16; 9 0,16; 10 0,14; 11 0,12; 12 0,10; 13 0,8; 14 0,6; 15 0,4; 16 0,2
445/030_SERIES_LITTELFUSE = drill 1.3 pad 2.54: P$1 -10.25,0; P$2 -5.05,0; P$3 10.25,0; P$4 5.05,0
TR5 = drill 0.813 pad 1.778 long: 1 -2.54,0; 2 2.54,0
FE05-2_RFM69PI_OULTINE = drill 0.914: 1 24.511,29.972 | drill 0.914 octagon: 2 21.971,29.972; 3 24.511,27.432; 4 21.971,27.432; 5 24.511,24.892; 6 21.971,24.892; 7 24.511,22.352; 8 21.971,22.352; 9 24.511,19.812; 10 21.971,19.812
TO92- = drill 0.813 octagon: 1 2.54,0; 2 0,0; 3 -2.54,0
CHIPLED_1206 = smd 1.5 x 1.5: A 0,-1.496; C 0,1.496
SOIC8_150MIL = smd 0.6 x 2.2: 1 -1.905,-2.6; 2 -0.635,-2.6; 3 0.635,-2.6; 4 1.905,-2.6; 5 1.905,2.6; 6 0.635,2.6; 7 -0.635,2.6; 8 -1.905,2.6
SOIC16 = smd 0.635 x 1.524: 1 -4.445,-2.695; 2 -3.175,-2.695; 3 -1.905,-2.695; 4 -0.635,-2.695; 5 0.635,-2.695; 6 1.905,-2.695; 7 3.175,-2.695; 8 4.445,-2.695; 9 4.445,2.695; 10 3.175,2.695; 11 1.905,2.695; 12 0.635,2.695; 13 -0.635,2.695; 14 -1.905,2.695; 15 -3.175,2.695; 16 -4.445,2.695
5,3//11-PAD = drill 5.3 pad 11: B5,5 0,0
47219-2001_MICROSD = smd 1.45 x 2: P$1 0,0; P$2 13.75,0; P$3 0,8.3; P$4 13.75,8.3 | smd 0.8 x 1.5: PIN1 10.08,2.6; PIN2 8.98,2.6; PIN3 7.88,2.6; PIN4 6.78,2.6; PIN5 5.68,2.6; PIN6 4.58,2.6; PIN7 3.48,2.6; PIN8 2.38,2.6
2/10,16 = drill 1.8 pad 3.5: P$1 -5.08,0; P$2 -5.08,10.16; P$3 5.08,0; P$4 5.08,10.16
B4B-PH-K = drill 0.813 square: 1 -3,0 | drill 0.813 octagon: 2 -1,0; 3 1,0; 4 3,0
SOIC_8 = smd 1.3 x 0.6: 1 -2.6,1.9; 2 -2.6,0.6; 3 -2.6,-0.6; 4 -2.6,-1.9; 5 2.7,-1.9; 6 2.7,-0.6; 7 2.7,0.6; 8 2.7,1.9
1X03 = drill 1.016 pad 1.88: 1 0,0; 2 2.54,0; 3 5.08,0
0207/2V = drill 0.813 octagon: 1 -1.27,0; 2 1.27,0
R0603 = smd 1 x 1.1: 1 -0.85,0; 2 0.85,0
0207/10 = drill 0.813 octagon: 1 -5.08,0; 2 5.08,0
0603 = smd 1.1 x 1: 1 -0.85,0; 2 0.85,0
SOT223 = smd 1.499 x 2.007: 1 -2.261,-3.15; 2 0.025,-3.15; 3 2.311,-3.15 | smd 3.81 x 2.007: 4 0,3.15
B3F-10XX = drill 1.016 long: 1 -3.251,2.261; 2 3.251,2.261; 3 -3.251,-2.261; 4 3.251,-2.261
S-PDSO-G08 = smd 0.4 x 1.2: 1 -0.975,-2.157; 2 -0.325,-2.157; 3 0.325,-2.157; 4 0.975,-2.157; 5 0.975,2.157; 6 0.325,2.157; 7 -0.325,2.157; 8 -0.975,2.157
SJ = smd 1.168 x 1.6: 1 -0.762,0; 2 0.762,0
P1-13 = drill 1.321 pad 2.159 octagon: TP 0,0
P1-13Y = drill 1.321 pad 1.905 long: TP 0,0
TP1.0 = drill 1: P$1 0,0
MA06-1 = drill 1.016 long: 1 0,0; 2 2.54,0; 3 5.08,0; 4 7.62,0; 5 10.16,0; 6 12.7,0
CRYSTAL_8X3.8 = smd 1.3 x 1.9: P$1 -2.75,-1.6; P$2 2.75,-1.6; P$3 2.75,1.6; P$4 -2.75,1.6

### Placement (x,y rotation side)
3.3V_BAT  65.01,21.1 270 bottom
7.62MM_5V_IN  85.08,63.5 0 top
ADC  94.71,2.03 0 top
BOOT  62.38,19.36 270 top
C1  54.73,55.08 90 top
C2  54.04,50.97 270 top
C3  54.52,47.22 270 top
C4  54.55,29.53 90 top
C5  54.04,25.47 270 top
C6  54.52,21.47 270 top
C7  61.58,56.13 90 top
C8  58.41,31.24 90 top
C9  68.2,46.37 0 bottom
C10  72.63,45.09 180 bottom
C11  68.2,43.78 0 bottom
C12  72.63,42.42 180 bottom
C13  68.19,41.15 0 bottom
C14  72.63,40.01 180 bottom
C15  68.19,38.61 0 bottom
C16  72.63,37.34 180 bottom
C17  91.75,24.49 270 top
C18  92.16,18.84 90 top
C19  79.89,47.36 90 top
C20  60.31,29.72 270 bottom
C21  58.15,43.18 270 bottom
C30T  87.57,54.7 180 top
C31T  91.76,54.55 0 top
C32T  95.85,54.13 90 top
C33T  74.75,10.49 270 bottom
CH_PD  92.19,8.45 270 top
CR1220  43.33,8.28 180 bottom
D1  51.36,70.57 0 top
D2  51.67,55.47 90 top
D3  51.67,46.47 270 top
D4  51.67,29.97 90 top
D5  51.67,20.97 270 top
D7  88,41.4 180 top
EBW_A  30.53,25.47 90 top
EBW_B  30.53,50.97 90 top
ESP-12  88.22,24.89 180 top
F1  34.34,72.87 0 top
F2  44.18,56.05 0 top
F3  44.18,45.89 0 top
F4  44.18,30.65 0 top
F5  44.18,20.49 0 top
GPIO_1  85.83,21.11 0 top
IC1  69.69,28.11 270 top
J5  72.33,33.77 0 top
LED1  109.74,61.24 90 top
LM258  62.26,40.98 180 top
LOGO1  87.92,0.78 0 bottom
MCP3208  73.19,41.87 270 top
MH1  6.57,44.72 0 top
MH2  6.57,57.22 0 top
MH3  6.57,19.22 0 top
MH4  6.57,31.72 0 top
MICRO_SD  52.08,1.46 90 top
MOUNT_10.16_A  12.43,50.93 270 top
MOUNT_10.16_B  12.43,25.53 270 top
P1  64.93,3.35 0 top
PCF8523  68.6,12.75 180 bottom
PWR  30.68,65.96 180 top
R1  55.64,42.27 90 top
R2  55.69,37.81 180 top
R3  56.39,17.93 90 top
R4  57.88,12.91 180 top
R5  110.21,57.63 180 top
R6  95.83,36.83 180 top
R7  95.87,33.53 0 top
R8  95.87,30.23 180 top
R9  79.76,41.14 0 top
R10  81.62,38.62 270 top
R11  68.63,20.93 180 top
R12  68.64,18.89 180 top
R13  68.64,16.84 180 top
R14  68.65,12.57 0 top
R15  68.64,10.35 180 top
R16  92.67,14.89 0 top
R17  92.75,12.42 0 top
R20  75.5,15.67 0 bottom
R21  75.48,13.59 0 bottom
R22  78.87,11.34 180 bottom
R25  95.83,36.83 180 top
R26  95.91,33.53 0 top
R27  95.96,30.23 180 top
REF_SEL_A  64.19,54.63 270 top
REF_SEL_B  64.2,31.78 270 top
REG1  90.84,47.76 180 top
REG2  99.84,47.75 180 top
RESET  108.32,18.67 90 top
RX  105.58,25.7 180 top
SHUNTMON-A  57.77,50.97 0 top
SHUNTMON-B  57.77,25.47 0 top
SJ1  86.72,11.71 90 bottom
SJ2  76.68,20.8 270 bottom
SJ3  36.4,49.52 0 bottom
SJ4  84.23,52.06 270 top
SJ5  90.71,40.32 270 top
SJ6  99.84,40.95 270 top
SJ7  36.1,24.02 180 bottom
SJ8  58.03,42.42 90 top
SJ9  59.17,17.02 90 top
SJ10  60.82,27.69 0 top
SJ11  60.82,53.09 0 top
TP1  84.23,56.34 0 top
TP2  87.28,44.21 0 top
TP3  103.39,44.46 0 top
TP4  58.41,74.42 90 top
TP5  99.05,74.42 90 top
TP6  99.05,56.64 90 top
TP7  58.41,56.64 90 top
TP8  17.51,21.84 90 top
TP9  17.51,29.46 90 top
TP10  17.51,47.24 90 top
TP11  17.51,54.86 270 top
TP12  22.24,6.92 180 top
TP13  25.74,6.92 180 top
TX  108.11,25.73 0 top
U$1  58.15,45.21 0 top
U$2  [ALIGNMENT_STOP]  21.34,9.22 0 top
U$3  [ALIGNMENT_STOP]  94.34,67.22 0 top
U$4  59.17,19.94 0 top
U$5  61.96,33.15 0 top
U$6  61.33,50.67 0 top
UART  86.59,26.42 180 top
Y1  59.95,9.09 0 bottom

### Tracks (layer width: path | path; a pad name or v marks a point on that pad's centre or on a via)
3.3V_PRE
  Top 0.406: TP3.TP 99.98,44.46 | 99.98,44.46 99.84,44.46 SJ6.1 | 99.98,44.46 REG2.4 99.81,44.63 99.81,45.21 99.81,46.48 REG2.2 99.81,50.92 arc90 98.16,52.58 96.54,52.58 arc-90 C32T.1
  Top 1.016: 101.59,44.63 103.22,44.63 arc-90 TP3.TP 101.83,44.46 arc-90 99.81,46.48 | 101.59,44.63 99.81,44.63 99.81,46.48 | 99.81,46.48 99.81,50.92 | REG2.4 SJ6.1 | REG2.4 99.84,45.19 arc90 99.81,45.21 | REG2.4 101.56,44.6 arc90 101.59,44.63
5V_PRE
  Top 0.406: REG1.2 90.84,50.88 90.84,47.75 | 90.84,45.21 REG1.4 90.43,44.21 TP2.TP 87.39,44.31 90.61,44.31 90.66,42.16 | SJ5.1 90.68,41.1 90.66,42.16 | 90.78,54.29 arc90 90.67,54.41 | D7.C 89.68,41.4 90,41.08 90,41.37 90.66,42.03 90.66,42.16
  Top 0.508: REG1.2 90.78,50.94 90.78,54.29
  Top 1.016: 7.62MM_5V_IN.2 90.41,68.58 arc-90 90.67,68.33 90.67,54.41 arc90 C31T.1 90.91,47.84 arc-90 TP2.TP 90.71,44.21 | SJ5.1 90.71,44.21 | 90.71,44.21 arc90 90.61,44.31 | 90.84,47.75 90.84,45.21
6.5V
  Top 0.406: SJ4.2 arc-90 84.62,50.91
  Top 0.508: REG1.3 88.47,50.96 88.47,54.18 arc90 C30T.1
  Top 1.016: 84.62,50.91 REG1.3
+3V3  (via drill 0.5)
  Top 0.254: R17.2 93.6,14.81 arc90 R16.2 93.52,23.64 arc-90 93.52,23.64 | 100.23,40.09 95.4,40.09 arc90 v93.39,38.07 | v88.53,37.95 83.84,37.95 arc90 82.62,36.74 82.62,36.62 arc-90 81.98,35.98 79.08,35.98 arc-90 78.41,36.66 78.41,37.02 arc90 v78.38,37.05 | v69.39,38.64 70.45,38.64 MCP3208.7 | v80.32,22.84 80.32,22.16 arc-90 74.05,15.89 68.33,15.89 | MICRO_SD.PIN4 61.78,8.24 | 61.78,8.24 arc90 64.95,11.41 64.95,12.51 arc-90 68.33,15.89 | R5.2 109.06,57.62 arc90 107.84,56.4 107.84,51.12 arc-90 GPIO_1.2 107.67,51.09 arc90 105.95,49.37 105.95,42.43 arc-90 103.6,40.09 | v68.46,8.47 arc-90 68.23,8.24 61.78,8.24 | v66.59,19.24 arc90 66.94,18.89 R12.2 R13.2 arc90 67.81,16.82 67.81,16.18 arc90 68.1,15.89 68.33,15.89
  Top 0.406: SJ6.2 arc90 99.94,40.09 100.23,40.09 103.6,40.09 arc-90 104.3,39.39 104.3,30.21 arc-90 102.28,28.19 100.7,28.19 arc90 100.06,27.56 100.06,27.18 arc-90 96.53,23.64 93.52,23.64 C17.2 v89.58,23.64 88.97,23.64 arc90 ESP-12.16
  Bottom 0.254: v93.39,38.07 88.64,38.07 arc90 v88.53,37.95 | v78.38,37.05 78.38,37.19 arc90 76.93,38.64 v69.39,38.64 | v69.39,38.64 69.07,38.64 | 69.35,38.61 arc90 v69.39,38.64 | v89.58,23.64 81.13,23.64 arc90 v80.32,22.84 77.95,22.84 arc90 SJ2.1 | P1.3 v68.46,8.47 | v66.59,19.24 66.59,20.27 arc90 3.3V_BAT.1 | C15.1 v69.39,38.64
+5V  (via drill 0.5)
  Top 0.254: v65.61,38.48 65.61,38.38 LM258.8 | 77.46,46.61 arc90 76.19,47.88 v68.44,47.88 | SHUNTMON-A.2 57.44,47.66 arc90 v57.86,47.24 | v57.82,21.78 57.75,21.78 arc-90 57.46,22.07 57.46,23.3 arc90 SHUNTMON-B.2 | v88.42,32.15 84.7,32.15 arc90 UART.4 | R25.2 R6.2
  Top 0.406: SJ5.2 90.85,39.55 arc90 95.24,43.94 95.24,48.62 arc-90 REG2.3 | SJ5.2 arc-90 90.75,39.51 R6.2 | SJ5.2 87.31,39.55 arc-90 82.54,44.32 82.54,45.21 arc90 81.27,46.48 79.92,46.48 arc-90 C19.1 78.73,46.51 | 78.73,46.51 77.46,46.51 | 77.46,46.51 76.09,46.51 arc90 MCP3208.16 | MCP3208.15 77.26,45.04 arc90 78.73,46.51 | 77.46,46.51 77.46,46.61
  Bottom 0.254: v68.44,47.88 66.92,47.88 arc90 65.65,46.61 65.65,46.48 | 65.65,46.48 65.65,38.52 | 65.65,46.48 58.62,46.48 arc-90 v57.86,47.24 | 63.49,35.31 63.36,35.31 | 57.83,21.8 arc90 58.41,22.37 58.41,30.23 arc-90 63.49,35.31 | 57.83,21.8 | 57.83,21.8 arc-90 v57.82,21.78 | 63.49,35.31 arc90 65.61,37.42 v65.61,38.48 | R6.2 90.59,36.83 arc90 88.42,34.66 v88.42,32.15
  Bottom 0.406: 65.65,38.52 arc-90 v65.61,38.48
ADC
  Top 0.254: ESP-12.10 88.64,10.89 arc-90 89.96,9.57 89.96,4.42 arc90 91.9,2.48 94.25,2.48 arc-90 ADC.1
ADCSHUNT_A  (via drill 0.5)
  Top 0.254: 61.35,50.33 arc90 65.36,46.31 v69.66,46.31 MCP3208.1 | 61.35,50.33 61.35,52.85 arc-90 SJ11.2 | U$6.P$1 61.33,50.35 arc90 61.35,50.33
  Bottom 0.254: v69.66,46.31 69.11,46.31 arc-90 C9.1
ADCSHUNT_B  (via drill 0.5)
  Top 0.254: v66.83,37.19 66.85,37.21 66.85,42.61 arc-90 68.02,43.77 v69.68,43.77 MCP3208.3 | v62.22,27.94 61.84,27.94 arc90 SJ10.2
  Bottom 0.254: v62.22,27.94 arc90 62.85,28.58 62.85,33.4 | 62.85,33.4 arc-90 63.49,34.04 63.68,34.04 arc90 v66.83,37.19 | v69.68,43.77 C11.1 arc-90 C11.1 | U$5.P$1 62.6,33.15 arc90 62.85,33.4
BI_REF  (via drill 0.5)
  Top 0.254: 100.95,36.79 100.95,35.16 | 100.95,35.16 R7.2 arc-90 99.94,32.51 97.78,32.51 arc-90 R26.2 | 100.95,35.16 96.51,35.16 | 96.51,35.16 v78.32,35.16 78.04,35.16 arc-90 77.55,35.65 77.55,36.08 arc90 77.37,36.26 73.36,36.26 arc-90 72.68,36.94 72.68,40.55 arc90 72,41.23 | v73.19,49.94 64.58,49.94 arc90 REF_SEL_A.3 | 72,41.23 72.88,41.23 arc90 73.36,41.72 v73.36,46.87 | v78.3,32.33 78.3,32.11 arc-90 77.96,31.77 74.11,31.77 arc90 71.38,29.04 71.38,28.52 arc-90 69.52,26.67 64.23,26.67 arc-90 REF_SEL_B.3 | R25.1 96.68,35.33 arc-90 96.51,35.16 | v69.63,41.21 arc-90 69.66,41.23 MCP3208.5 72,41.23
  Top 0.406: R6.1 arc-90 100.95,36.79
  Bottom 0.254: v73.36,46.87 73.36,49.77 arc90 v73.19,49.94 | v78.32,35.16 78.32,32.36 arc-90 v78.3,32.33 | v69.63,41.21 69.1,41.21 arc90 C13.1
CH7  (via drill 0.5)
  Top 0.254: MCP3208.8 70.5,36.79 arc-90 v70.49,36.78
  Bottom 0.254: C16.1 71.22,36.78 v70.49,36.78 70.49,35.61 arc90 J5.1
CH_PD  (via drill 0.5)
  Top 0.254: ESP-12.11 arc90 88.7,12.42 R17.1 92.19,12.13 92.19,8.9 | 92.19,8.9 | 92.19,8.9 CH_PD.1 arc90 94.57,10.84 v94.53,18.02 | C18.1 92.45,17.99 arc-90 v92.51,17.93
  Bottom 0.254: v92.51,17.93 94.43,17.93 v94.52,18.02 v94.53,18.02
D0/RX
  Top 0.254: GPIO_1.7 110.62,43.47 arc-90 111.68,42.41 111.68,26.76 arc-90 TX.2
D1/TX
  Top 0.254: RX.1 105.58,26.87 arc-90 107.86,29.15 108.09,29.15 arc90 110.4,31.47 110.4,40.86 arc90 GPIO_1.9
ESPRX  (via drill 0.5)
  Top 0.254: R14.2 R15.1 | R15.1 arc-90 R15.1 | ESP-12.7 70.03,10.89 arc90 R15.1 | R15.1 arc90 69.48,10.34 69.48,8.62 arc90 70.43,7.66 87.68,7.66 arc-90 v88.14,7.2 | v102.48,17.53 arc90 103.04,18.09 RX.2 | v101.97,15.62 99.81,15.62 arc90 95.36,11.18 95.36,8.01 arc-90 v94.52,7.16 arc90 94.44,7.24
  Bottom 0.254: v102.48,17.53 102.48,16.13 arc-90 v101.97,15.62 | 94.49,7.19 v94.52,7.16 94.5,7.18 88.17,7.18 arc-90 v88.14,7.2
ESPTX  (via drill 0.5)
  Top 0.254: ESP-12.8 74.59,8.89 arc90 84.12,18.43 84.12,26.36 arc90 UART.2 84.05,27.01 arc-90 85.77,28.73 87.34,28.73 arc-90 88.76,27.3 arc90 89.4,26.67 v98.79,26.66
  Bottom 0.254: v98.79,26.66 100.95,26.67 arc90 101.46,27.18 arc-90 101.84,27.56 106.29,27.56 arc-90 TX.1
GND  (via drill 0.5, 3.3 pad 5.59)
  other vias: 16.68,67.2 98.67,67.22 16.68,9.19 98.67,9.19 59.07,47.48 59.41,22.1 51.7,57.98 51.7,43.98 51.7,35.66 53.47,17.21 49.92,59.51 53.77,58.47 53.5,41.71 50.41,41.18 49.7,16.85 49.73,18.1 53.51,33.98 50.18,35.03 58.34,70.62 56.65,70.41 57.54,69.15 87.42,58.96 97.94,54.65 97.11,44.82 59.78,43.69 81.01,48.27 60.53,59.5 59.51,59.5 58.5,59.5 57.48,59.5 56.47,59.5 56.47,58.49 57.48,58.49 58.5,58.49 59.51,58.49 60.53,58.49 98.95,54.65 99.97,54.65 99.97,53.63 98.95,53.63 97.94,53.63 97.94,58.46 98.95,58.46 99.97,58.46 99.97,59.47 98.95,59.47 97.94,59.47 88.69,58.96 86.15,58.96 51.98,40.57 53.26,59.62 77,37.35 77.65,43.79 94.86,25.31 67.12,14.66 86.78,41.54 86.78,36.59 102.91,52.21 93.76,51.96 70.14,23.51 71.54,24.91 73.95,23.13 47.39,5.98 59.73,25.85 58.84,35.25 98.67,33.82 91.99,31.76 75.85,52.5 77.86,55.24 66.84,69.13 69.23,64.88
  pour Bottom (isolate 0.305, rank 3, no thermals): 13.45,76.2 13.45,64.11 41.4,64.11 41.4,11.96 13.45,11.96 13.45,0.25 102.35,0.25 102.35,12.95 113.9,12.95 113.9,63.5 102.35,63.5 102.35,76.2
  pour Top (isolate 0.254, rank 3, no thermals): 13.45,76.33 13.45,64.13 41.52,64.13 41.52,12.01 13.45,12.01 13.45,0.25 102.35,0.25 102.35,12.95 113.9,12.95 113.9,63.5 102.35,63.5 102.35,76.2
GPIO0  (via drill 0.5)
  Top 0.254: ESP-12.4 arc-90 71.97,16.84 v70.34,16.84 R13.1 | v65.59,16.51 62.68,16.51 arc-90 BOOT.2 | v68.22,24.81 arc-90 67.21,23.81 63.2,23.81 arc90 v62.46,23.07
  Bottom 0.254: v70.34,16.84 65.92,16.84 arc90 v65.59,16.51 | IC1.2 arc90 68.22,26.64 v68.22,24.81 | v62.46,23.07 arc90 61.02,21.63 61.02,17.99 arc90 62.19,16.82 BOOT.2
GPIO2  (via drill 0.5)
  Top 0.254: R12.1 arc90 R12.1 ESP-12.3 arc90 77.71,24.58 77.71,29.48 arc-90 78.62,30.38 78.73,30.38 arc90 79.8,31.45 v79.8,32.38 | MCP3208.10 78.04,38.69 arc-90 v79.92,36.82
  Bottom 0.254: v79.92,36.82 79.92,32.5 arc-90 v79.8,32.38
GPIO12  (via drill 0.5)
  Top 0.254: R9.2 81.61,40.13 R10.1 81.61,40.22 arc-90 v81.73,40.34 | v83.02,31.02 86.64,31.02 arc-90 v89.78,27.87 | v90.15,18.89 ESP-12.14 arc90 ESP-12.14 86.4,18.89 arc90 85.33,17.83 82.96,12.39 v82.96,11.51 | MICRO_SD.PIN7 68.53,4.94 arc90 v70.07,6.47
  Bottom 0.254: v81.73,40.34 81.73,32.3 arc90 v83.02,31.02 | v90.15,18.89 arc90 91.02,19.76 91.02,26.83 arc90 89.98,27.87 v89.78,27.87 | v70.07,6.47 70.07,6.79 arc-90 70.71,7.43 78.88,7.43 arc90 v82.96,11.51
GPIO12A
  Top 0.254: R9.1 78.82,41.23 MCP3208.12
GPIO13  (via drill 0.5)
  Top 0.254: MCP3208.11 78.74,39.96 arc-90 v79.98,38.73 | v81.92,30.18 82.09,30.18 arc-90 82.73,29.54 82.73,21.25 arc90 v83.04,20.94 | v89.96,21 88.33,21 arc90 ESP-12.15 | MICRO_SD.PIN3 58.77,9.34 arc90 62.71,13.28 62.71,13.46 arc-90 64.73,15.48 65.34,15.48 arc90 66.46,16.6 v66.46,17.75 | v74,17.71 75.98,17.71 arc90 v79.22,20.94
  Bottom 0.254: v79.98,38.73 80.01,38.73 arc-90 81.01,37.73 81.01,31.09 arc90 v81.92,30.18 | v89.96,21 arc-90 89.9,20.94 v83.04,20.94 v79.22,20.94 | v74,17.71 73.95,17.75 v66.46,17.75
GPIO14  (via drill 0.5)
  Top 0.254: MCP3208.13 80.24,42.5 arc-90 v83.32,39.42 | v84.92,30.18 arc90 85.64,29.46 v88.26,29.46 | v90.24,16.98 arc-90 90.15,16.89 ESP-12.13 arc-90 88.13,16.8 87.55,16.8 arc90 84.45,13.7 84.45,13.48 arc-90 79.47,8.5 v78.1,8.5 | MICRO_SD.PIN5 68.69,7.14 arc90 v68.86,7.31
  Bottom 0.254: v83.32,39.42 83.32,32.81 arc90 84.24,31.88 arc-90 84.92,31.21 v84.92,30.18 | v88.26,29.46 arc90 88.79,28.93 90.71,28.93 arc-90 91.72,27.92 91.72,18.36 arc-90 90.34,16.98 v90.24,16.98 | v78.1,8.5 arc-90 77.86,8.26 69.81,8.26 arc90 v68.86,7.31
GPIO15
  Top 0.254: ESP-12.2 69.52,20.89 arc90 R11.1 69.48,21.44 arc90 68.67,22.26 63.76,22.26 arc90 60.61,19.1 60.61,13.01 arc-90 58.04,10.45 MICRO_SD.PIN2 arc90 MICRO_SD.PIN2
GPIO16  (via drill 0.5)
  Top 0.254: v85.87,14.42 87.75,14.42 arc90 ESP-12.12 arc-143 88.89,15.11 v92.55,16.62 | RESET.1 arc90 104.86,16.62 arc90 104.84,16.64 v95.49,16.64
  Bottom 0.254: SJ1.2 86.72,13.57 arc90 v85.87,14.42 | v92.55,16.62 95.47,16.62 arc90 v95.49,16.64
LOAD-NEG-A
  Top 0.61: F2.1 30.85,56.05 EBW_B.P$2
  pour Top (no thermals): 0.34,62.72 37.15,62.72 37.15,51.72 0.34,51.72
  pour Bottom (isolate 0.813, no thermals): 35.88,62.72 0.34,62.72 0.34,51.72 35.88,51.72
LOAD-NEG-A_T
  Top 0.254: D2.C 51.67,52.97 | C1.1 54.73,53.91 arc90 54.77,53.87
  Top 0.406: 54.04,52.97 51.67,52.97 arc90 51.63,53.02 49.62,53.02 arc-90 46.72,55.91 F2.2 | 54.04,52.97 54.77,52.97 | 54.77,52.97 56.79,52.97 SHUNTMON-A.8 | C2.1 54.04,52.97 | 54.77,53.87 54.77,52.97
LOAD-NEG-B
  Top 0.61: F4.1 32.09,30.65 EBW_A.P$26
  pour Top (no thermals): 0.34,37.22 37.15,37.22 37.15,26.22 0.34,26.22
  pour Bottom (isolate 0.813, no thermals): 35.88,37.22 0.34,37.22 0.34,26.22 35.88,26.22
LOAD-NEG-B_T
  Top 0.254: C4.1 54.55,27.5 arc90 54.58,27.47
  Top 0.406: 54.04,27.47 54.58,27.47 56.79,27.47 SHUNTMON-B.8 | C5.1 54.04,27.47 | 54.04,27.47 51.72,27.47 | 51.72,27.47 51.17,27.47 51,27.64 | F4.2 46.72,30.39 arc90 49.48,27.64 51.54,27.64 arc-90 51.72,27.47
  Top 0.61: 51,27.64 51.22,27.42 D4.C
N$1
  Top 1.016: TP5.TP 88.13,74.42 arc90 84.32,70.61 84.32,56.42 arc-90 TP1.TP SJ4.1 arc-90 SJ4.1
N$3
  Bottom 1.016: SJ3.1 37.16,60.79 arc90 34.43,63.52 28.04,63.52 arc-90 PWR.3
N$4
  Bottom 1.016: SJ7.2 arc90 39.41,26.57 39.41,60.53 arc90 34.1,65.84 30.81,65.84 arc-90 PWR.1
N$5
  Top 0.406: LED1.A 111.23,58.37 R5.1
N$10
  Top 0.254: SHUNTMON-B.5 60,27.63 arc90 SJ10.1
N$11
  Top 0.254: SJ11.1 58.79,53.09 arc-90 SHUNTMON-A.5
N$36
  Top 0.254: R14.1 arc-90 69.12,13.9 75.05,13.9 arc90 81.51,20.36 UART.3
N$44
  Bottom 0.254: Y1.P$4 62.83,10.69 arc-46 PCF8523.2
N$45
  Bottom 0.254: Y1.P$1 64.46,9.76 arc-34 PCF8523.1
REF_A_INPUT
  Top 0.254: REF_SEL_A.2 63.31,52.09 arc-90 62.6,52.8 62.6,54.48 arc90 61.8,55.28 C7.1 arc-90 61.38,55.08 58.02,55.08 | 58.02,55.08 arc90 57.46,54.52 57.46,53.14 arc-90 SHUNTMON-A.7 | SHUNTMON-A.6 58.09,55.01 arc90 58.02,55.08
REF_B_INPUT
  Top 0.254: REF_SEL_B.2 58.37,29.24 | 58.37,29.24 58.11,29.24 | 58.11,29.24 57.91,29.24 arc90 57.44,28.76 SHUNTMON-B.7 arc90 SHUNTMON-B.7 | SHUNTMON-B.6 58.09,29.22 arc-90 58.11,29.24 | C8.1 58.41,29.27 arc-90 58.37,29.24
RESET
  Top 0.254: C18.2 arc90 91.97,19.87 86.91,19.87 arc-90 86.29,20.49 86.29,26.12 arc-90 UART.1
RST  (via drill 0.5)
  Top 0.254: ESP-12.9 86.57,8.89 arc-90 v86.54,8.92 | v90.63,14.37 R16.1
  Bottom 0.254: 86.75,10.7 86.75,10.92 SJ1.1 | 86.75,10.7 86.75,9.13 v86.54,8.92 | v90.63,14.37 90.29,14.37 arc90 88.12,12.19 88.12,12.07 arc-90 86.75,10.7
SCL  (via drill 0.5)
  Top 0.254: ESP-12.6 v73.01,12.88
  Bottom 0.254: P1.2 69.62,11.69 arc36 69.86,12.51 arc-104 70.71,13.22 arc49 PCF8523.6 v73.01,12.88
SDA  (via drill 0.5)
  Top 0.254: ESP-12.5 v73.05,14.87
  Bottom 0.254: P1.1 69.66,13.53 arc-10 70.57,14.54 arc-69 PCF8523.5 72.4,14.65 v73.05,14.87
SOURCE-POS-A
  Top 0.61: F3.1 29.88,45.89 29.83,45.85
  Bottom 1.016: EBW_B.P$7 35.17,47.22
  pour Top (no thermals): 0.34,50.22 37.15,50.22 37.15,39.22 0.34,39.22
  pour Bottom (isolate 0.813, no thermals): 35.88,50.22 0.34,50.22 0.34,39.22 35.88,39.22
SOURCE-POS-A_T
  Top 0.254: SHUNTMON-A.1 56.79,46.01 arc-90 56.25,45.47 arc90 55.64,44.86 R1.2
  Top 0.305: D3.C 51.67,48.97
  Top 0.406: 54.04,48.97 51.67,48.97 arc-90 51.67,48.97 49.69,48.97 arc90 46.72,46 F3.2 | 54.04,48.97 54.77,48.97 | 54.77,48.97 56.79,48.97 SHUNTMON-A.1 56.79,48.68 | C2.2 54.04,48.97 | C3.1 54.77,48.07 54.77,48.97
SOURCE-POS-B
  Top 0.61: F5.1 31.78,20.49 31.74,20.45
  Bottom 1.016: EBW_A.P$5 33.27,21.72
  pour Top (no thermals): 0.34,24.72 37.15,24.72 37.15,13.72 0.34,13.72
  pour Bottom (isolate 0.813, no thermals): 35.88,24.72 0.34,24.72 0.34,13.72 35.88,13.72
SOURCE-POS-B_T
  Top 0.254: SHUNTMON-B.1 56.79,19.81 | 56.79,19.81 56.79,19.58 | R3.2 arc90 56.79,19.6 56.79,19.81
  Top 0.305: D5.C 51.67,23.47
  Top 0.406: 54.04,23.47 51.67,23.47 arc90 51.62,23.52 49.62,23.52 arc90 46.72,20.63 F5.2 | 54.52,23.47 56.79,23.47 SHUNTMON-B.1 | C5.2 54.04,23.47 | 54.04,23.47 54.52,23.47 | 54.52,23.47 C6.1
UNI_REF  (via drill 0.5)
  Top 0.254: R7.1 v85.06,33.53 77.9,33.52 arc-90 77.06,34.37 77.06,34.69 arc90 76.05,35.7 72.8,35.7 arc-90 72.76,35.73 72.64,35.73 arc-90 71.99,36.38 | 71.99,36.38 71.99,39.39 arc90 v71.44,39.95 70.51,39.95 MCP3208.6 | REF_SEL_A.1 arc-90 64.3,54.73 73.24,54.73 arc-90 84.38,43.59 v84.38,42.63 | REF_SEL_B.1 66.92,31.78 arc90 69.61,34.47 69.61,34.81 arc-90 70.48,35.68 71.29,35.68 arc90 71.99,36.38 | R7.1 R8.2 | R27.2 95.11,33.48 arc90 R26.1 R7.1
  Bottom 0.254: v85.06,33.53 85.06,41.95 arc90 v84.38,42.63 | v71.44,39.95 arc-90 71.49,40.01 C14.1
V_IN_POSTFUSE
  Top 1.016: F1.P$3 48.42,72.87 | 48.42,72.87 49.52,72.87 | 49.52,72.87 56.86,72.87 arc90 TP4.TP | D1.C 48.81,72.16 arc-90 49.52,72.87 | D1.C arc-90 48.42,70.96 48.42,72.87 | D1.C arc90 49.35,71.11 49.35,72.82
  Bottom 1.27: F1.P$4 F1.P$3
V_IN_PREFUSE
  Bottom 1.016: F1.P$1 F1.P$2 arc90 28.14,71.72 PWR.2
VBAT
  Bottom 0.254: 3.3V_BAT.2 65.01,20.01 64.53,20.01 64.53,14.69 | 64.53,14.69 64.53,13.82 arc90 65.03,13.32 65.97,13.32 arc90 PCF8523.3 | CR1220.P+ 51.63,10.46 arc-90 55.81,14.63 64.48,14.63 arc90 64.53,14.69
VDD_PCF
  Bottom 0.254: PCF8523.8 73.34,10.85 arc90 73.63,11.14 73.63,11.19 arc-90 73.79,11.36 74.48,11.36 | 74.48,11.36 74.73,11.36 arc-90 C33T.1 | R22.1 74.5,11.34 arc-90 74.48,11.36
VDD_RTC_POSTJUMPER
  Bottom 0.254: R22.2 79.5,11.34 arc90 77.19,13.65 76.39,13.65 arc-90 R21.1 76.33,15.65 arc-90 R20.1 76.35,19.71 arc-90 SJ2.2
VSENSE_A
  Top 0.254: 57.67,41.3 arc90 SJ8.1 56.29,41.66 arc90 R1.1 55.64,40.3 arc-90 54.98,39.64 | 54.93,39.64 arc90 54.44,39.16 54.44,37.83
  Top 0.406: 54.98,39.64 54.93,39.64 | 54.44,37.83 arc-90 R2.2
VSENSE_A_BUFFED  (via drill 0.5)
  Top 0.254: LM258.2 LM258.1 arc-90 65.62,45.04 MCP3208.2 v71.25,45.04 arc-90 v71.25,45.04
  Bottom 0.254: v71.25,45.04 71.74,45.04 arc90 C10.1
VSENSE_A_TP
  Top 0.254: LM258.3 arc-90 61.58,43.63 61.58,44.58 arc90 60.57,45.59 58.54,45.59 arc90 U$1.P$1 58.15,43.31 arc-90 SJ8.2
  Bottom 0.254: C21.1 U$1.P$1
VSENSE_B
  Top 0.254: SJ9.1 56.79,16.26 arc-90 R3.1 56.39,13.13 arc90 R4.2
VSENSE_B_BUFFED  (via drill 0.5)
  Top 0.254: LM258.6 LM258.7 arc-90 62.91,38.37 62.91,37.18 arc90 63.8,36.3 66.81,36.3 arc90 67.83,37.32 67.83,41.24 arc-90 69.09,42.5 MCP3208.4 arc-90 MCP3208.4 v71.4,42.51
  Bottom 0.254: C12.1 71.48,42.42 arc-90 v71.4,42.51
VSENSE_B_TP  (via drill 0.5)
  Top 0.254: SJ9.2 U$4.P$1 59.17,20.19 arc-90 59.93,20.96 60.06,20.96 arc90 60.44,21.34 60.44,24.64 arc-90 v61.46,25.65 | v61.46,30.73 61.46,31.62 arc90 60.95,32.13 60.82,32.13 arc-90 60.31,32.64 60.31,38.34 arc-90 LM258.5
  Bottom 0.254: v61.46,25.65 61.33,25.78 61.33,30.61 v61.46,30.73 60.48,30.73 arc90 C20.1

### Text on the board
bPlace: emonDC | wireless energy monitoring node | Technology that helps us live within ecological limits | Lead free PCB - RoHS components | OpenEnergyMonitor.org | Open / Hardware | Designed in North Wales / by Daniel Bates
tNames: +IN | +OUT | DC-DC Buck Regulator / Set to 6.5V | 5x20 | 5V_IN | A | B | ***PREPARE FOR*** / HIGH FLOATING / VOLTAGES | GND | LOAD | - | TERMINAL | PWR_ON | LOAD | A | LMP8481 | SOURCE | SOURCE | + | TR5 / FUSES | LOAD | - | CH7 | GND | LOAD | RFM | LMP8481 | B | SOURCE | + | SOURCE | 3.5 | GND | LCD | I2C | 1V
tSilk: UNI | A | REF | RFM69Pi | B | UNI | GND | 5V | Tx | Rx | RST | REF | emonDC / _duo_ | Wireless Energy / Monitoring Node | v3.3 Dec 2018 by DB
_tsilk: Designed in | North Wales | Made in UK
_bsilk: SMT V0.6 rev3 | emonTx | wireless energy monitoring node | SMT V0.6 rev3 | emonTx | SMT V0.6 rev3 | emonTx | Technology that helps us live within ecological limits | wireless energy monitoring node | wireless energy monitoring node | Designed in North Wales UK by Glyn Hudson & Trystan Lea | Technology that helps us live within ecological limits | Technology that helps us live within ecological limits | Designed in North Wales UK by Glyn Hudson & Trystan Lea | 165mm ant | 433Mhz | Designed in North Wales UK by Glyn Hudson & Trystan Lea | 165mm ant | 165mm ant | 433Mhz | 433Mhz | 868Mhz | 82mm ant | 82mm ant | 82mm ant | 868Mhz | 868Mhz | 78mm ant | 915Mhz | 78mm ant | 915Mhz | 78mm ant | 915Mhz | 165mm ant | 433Mhz | 82mm ant | 868Mhz | 78mm ant | 915Mhz